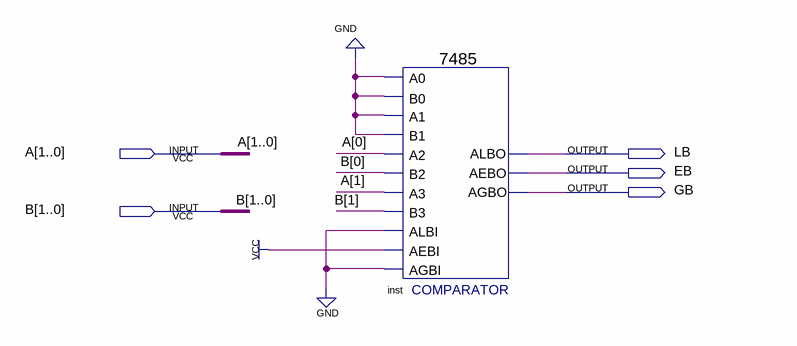
[diagram p0: schematic sheet]
// Quartus schematic block2.bdf as structural Verilog: 1 symbols, 5 pins
module block2 (
  input  [1:0] A,
  input  [1:0] B,
  output LB,
  output EB,
  output GB
);

  \7485  inst (
    .A3(A[1]), .B2(B[0]), .A2(A[0]), .AEBI(1'b1), .AGBI(1'b0), .ALBI(1'b0), .A0(1'b0), .B0(1'b0), .B3(B[1]),
    .A1(1'b0), .B1(1'b0), .ALBO(LB), .AGBO(GB), .AEBO(EB));
endmodule
